# EAGLE board Moonwalker (EAGLE 6.3)
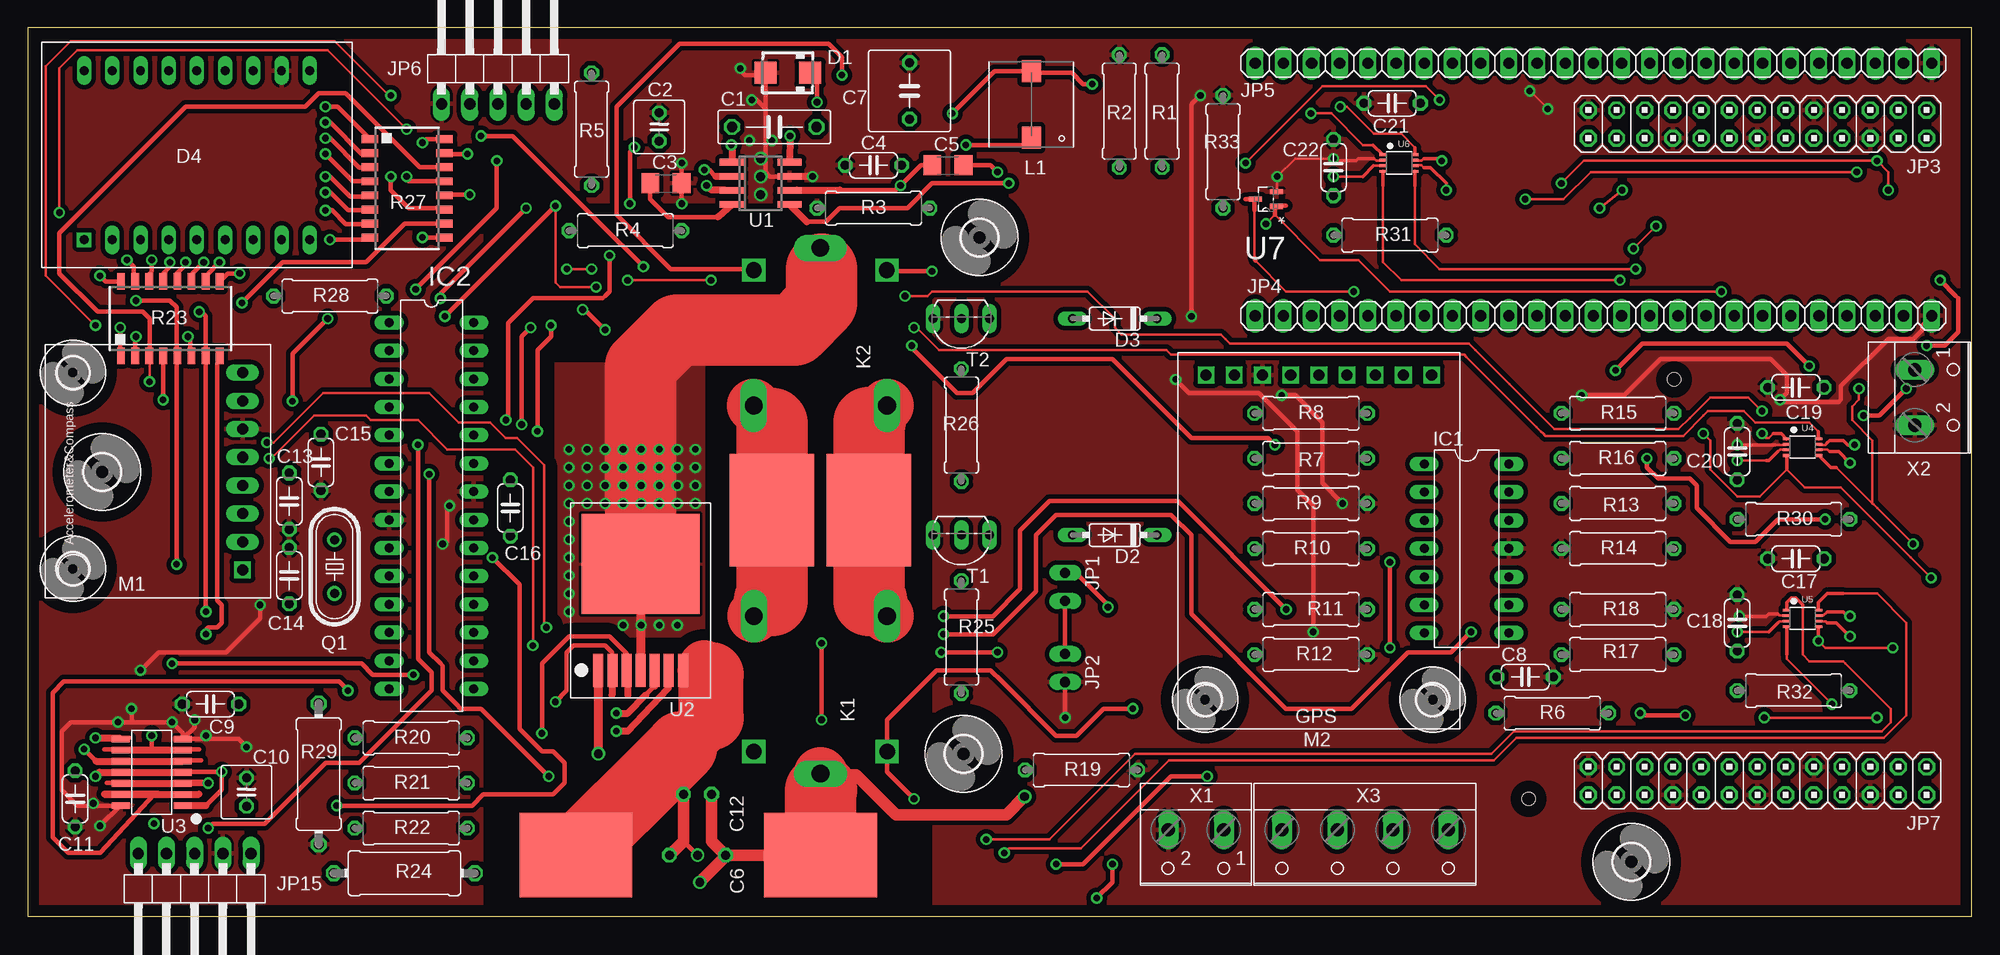
[diagram p5: board, top side]
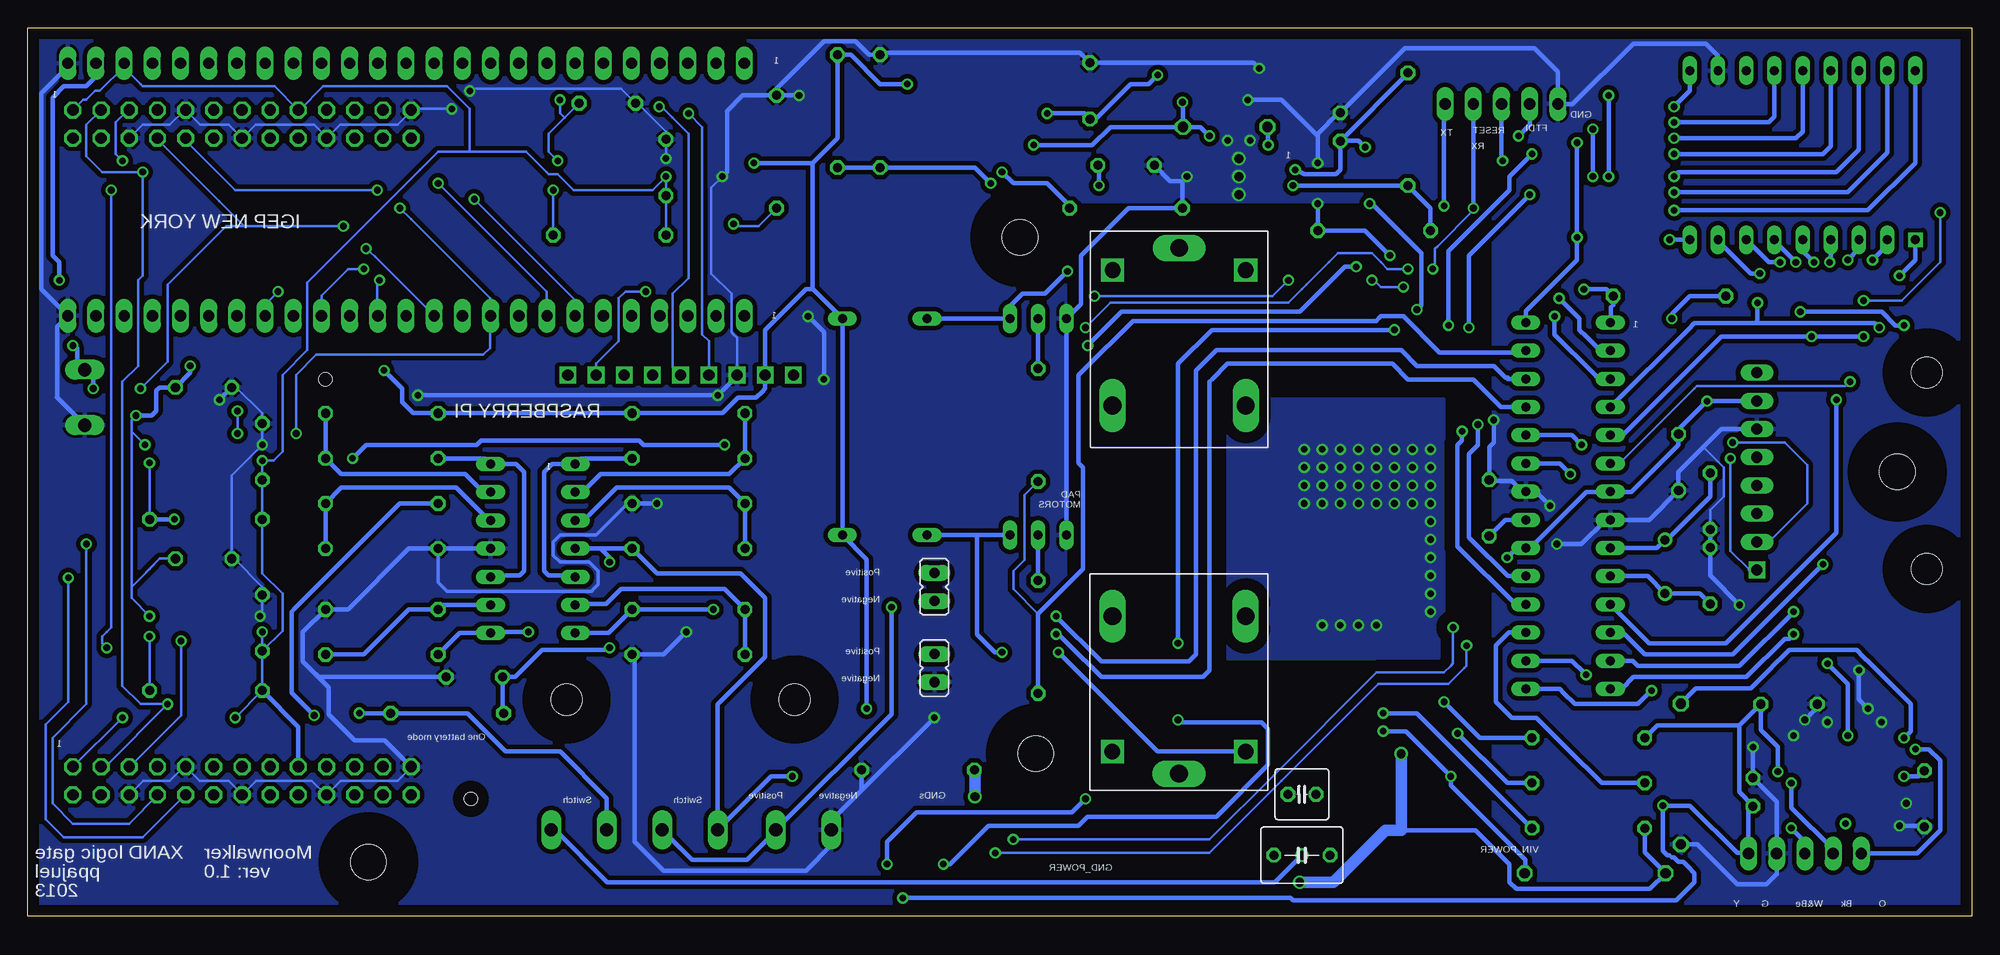
[diagram p6: board, bottom side, seen from below]

Size 175.16 x 80.06 mm. Coordinates in mm from the lower left corner, seen from the top.
Outline: 0,0 175.16,0 175.16,80.06 0,80.06 0,0
Copper layers (1*16): Top 0.07mm / dielectric 1.86mm / Bottom 0.07mm
Design rules "default_moonwalker1": minimum track width 8mil, minimum drill 12mil, track to track 8mil, track to pad 8mil, pad to pad 8mil, via to via 8mil, smd to smd 8mil, copper to edge 40mil, drill to drill 8mil, minimum pad ring 10mil, minimum via ring 8mil, stop-mask expansion 4mil, vias tented up to drill 0mil, thermal gap 10mil
Holes 1.2 mm at 135.23,10.57 148.34,48.36

## Footprints (pad centres in the part's own frame; a part is rotated, then mirrored left to right if it is on the bottom)
C075-032X103 = drill 0.914 octagon: 1 -3.81,0; 2 3.81,0
C025-050X050 = drill 0.813 octagon: 1 -1.27,0; 2 1.27,0
C1206 = smd 1.6 x 1.8: 1 -1.4,0; 2 1.4,0
C050-024X044 = drill 0.813 octagon: 1 -2.54,0; 2 2.54,0
C050-050X075 = drill 0.813 octagon: 1 -2.54,0; 2 2.54,0
C050-075X075 = drill 0.813 octagon: 1 -2.54,0; 2 2.54,0
SMA = smd 2 x 2: A 2,0; C -2,0
DO35-7 = drill 0.813 long: A 3.81,0; C -3.81,0
HEX_SEGMENT_1_DIGIT_0.8 = drill 0.8 square: 1 0,0 | drill 0.8 long: 2 0,-2.54; 3 0,-5.08; 4 0,-7.62; 5 0,-10.16; 6 0,-12.7; 7 0,-15.24; 8 0,-17.78; 9 0,-20.32; 10 15.24,-20.32; 11 15.24,-17.78; 12 15.24,-15.24; 13 15.24,-12.7; 14 15.24,-10.16; 15 15.24,-7.62; 16 15.24,-5.08; 17 15.24,-2.54; 18 15.24,0
3,2 = hole 3.2: 0,0
2,8 = hole 2.8: 0,0
DIL14 = drill 0.813 long: 1 -7.62,-3.81; 2 -5.08,-3.81; 3 -2.54,-3.81; 4 0,-3.81; 5 2.54,-3.81; 6 5.08,-3.81; 7 7.62,-3.81; 8 7.62,3.81; 9 5.08,3.81; 10 2.54,3.81; 11 0,3.81; 12 -2.54,3.81; 13 -5.08,3.81; 14 -7.62,3.81
DIL28-3 = drill 0.813 long: 1 -16.51,-3.81; 2 -13.97,-3.81; 3 -11.43,-3.81; 4 -8.89,-3.81; 5 -6.35,-3.81; 6 -3.81,-3.81; 7 -1.27,-3.81; 8 1.27,-3.81; 9 3.81,-3.81; 10 6.35,-3.81; 11 8.89,-3.81; 12 11.43,-3.81; 13 13.97,-3.81; 14 16.51,-3.81; 15 16.51,3.81; 16 13.97,3.81; 17 11.43,3.81; 18 8.89,3.81; 19 6.35,3.81; 20 3.81,3.81; 21 1.27,3.81; 22 -1.27,3.81; 23 -3.81,3.81; 24 -6.35,3.81; 25 -8.89,3.81; 26 -11.43,3.81; 27 -13.97,3.81; 28 -16.51,3.81
JP1 = drill 0.914 long: 1 0,-1.27; 2 0,1.27
2X13 = drill 1.016 octagon: 1 -15.24,-1.27; 2 -15.24,1.27; 3 -12.7,-1.27; 4 -12.7,1.27; 5 -10.16,-1.27; 6 -10.16,1.27; 7 -7.62,-1.27; 8 -7.62,1.27; 9 -5.08,-1.27; 10 -5.08,1.27; 11 -2.54,-1.27; 12 -2.54,1.27; 13 0,-1.27; 14 0,1.27; 15 2.54,-1.27; 16 2.54,1.27; 17 5.08,-1.27; 18 5.08,1.27; 19 7.62,-1.27; 20 7.62,1.27; 21 10.16,-1.27; 22 10.16,1.27; 23 12.7,-1.27; 24 12.7,1.27; 25 15.24,-1.27; 26 15.24,1.27
1X25 = drill 1.016 long: 1 -29.21,0; 2 -26.67,0; 3 -24.13,0; 4 -21.59,0; 5 -19.05,0; 6 -16.51,0; 7 -13.97,0; 8 -11.43,0; 9 -8.89,0; 10 -6.35,0; 11 -3.81,0; 12 -1.27,0; 13 1.27,0; 14 3.81,0; 15 6.35,0; 16 8.89,0; 17 11.43,0; 18 13.97,0; 19 16.51,0; 20 19.05,0; 21 21.59,0; 22 24.13,0; 23 26.67,0; 24 29.21,0; 25 31.75,0
1X05/90 = drill 1.016 long: 1 -5.08,-3.81; 2 -2.54,-3.81; 3 0,-3.81; 4 2.54,-3.81; 5 5.08,-3.81
POWER_PAD = smd 7.62 x 10.16: 1 0,0
FINDERSERIE36 = drill 1.4 square: 1 0,12; 3 0,0 | drill 1.6 long: 2 -2,6; 4 12.2,0; 5 12.2,12
WE-PD_7332/7345_PLASTIC_BASE = smd 1.7 x 2: 1 0,3; 2 0,-3
COMPASS_&_ACCELEROMETER_ADAFRUIT_LSM303 = drill 1 square: 1 2.54,2.54 | drill 1 long: 2 5.08,2.54; 3 7.62,2.54; 4 10.16,2.54; 5 12.7,2.54; 6 15.24,2.54; 7 17.78,2.54; 8 20.32,2.54
ULTIMATE_GPS_MODULE = drill 1 square: 1 2.54,2.032; 2 5.08,2.032; 3 7.62,2.032; 4 10.16,2.032; 5 12.7,2.032; 6 15.24,2.032; 7 17.78,2.032; 8 20.32,2.032; 9 22.86,2.032
HC49/S = drill 0.813: 1 -2.413,0; 2 2.413,0
0309/10 = drill 0.813 octagon: 1 -5.08,0; 2 5.08,0
4816P = smd 0.7 x 1.5: 1 -4.445,-3.346; 2 -3.175,-3.346; 3 -1.905,-3.346; 4 -0.635,-3.346; 5 0.635,-3.346; 6 1.905,-3.346; 7 3.175,-3.346; 8 4.445,-3.346; 9 4.445,3.346; 10 3.175,3.346; 11 1.905,3.346; 12 0.635,3.346; 13 -0.635,3.346; 14 -1.905,3.346; 15 -3.175,3.346; 16 -4.445,3.346
0411/12 = drill 0.914 octagon: 1 -6.35,0; 2 6.35,0
TO92-CBE = drill 0.813 long: B 0,0; C -2.54,0; E 2.54,0
SO8 = smd 0.6 x 2.2: 1 -1.905,-2.6; 2 -0.635,-2.6; 3 0.635,-2.6; 4 1.905,-2.6; 5 1.905,2.6; 6 0.635,2.6; 7 -0.635,2.6; 8 -1.905,2.6
TO263 = smd 0.9 x 2.95: 1 0,0; 2 1.27,0; 3 2.54,0; 4 3.81,0; 5 5.08,0; 6 6.35,0; 7 7.62,0 | smd 10.6 x 9: 8 3.81,9.6
SOIC14W = smd 1.6 x 0.6: 1 0,0; 2 0,-1; 3 0,-2; 4 0,-3; 5 0,-4; 6 0,-5; 7 0,-6; 8 5.6,-6; 9 5.6,-5; 10 5.6,-4; 11 5.6,-3; 12 5.6,-2; 13 5.6,-1; 14 5.6,0
VFSOP-8 = smd 0.25 x 0.65: P$1 -0.75,-1.45; P$2 -0.25,-1.45; P$3 0.25,-1.45; P$4 0.75,-1.45; P$5 0.75,1.45; P$6 0.25,1.45; P$7 -0.25,1.45; P$8 -0.75,1.45
SOT65P210X110-3N = smd 1.168 x 0.457: 1 -0.94,0.66; 2 -0.94,-0.66; 3 0.94,0
W237-102 = drill 1.194 long: 1 -2.5,-1.27; 2 2.5,-1.27
W237-4 = drill 1.194 long: 1 -7.5,-1.27; 2 -2.5,-1.27; 3 2.5,-1.27; 4 7.5,-1.27

## Placement (x,y rotation side)
C1  100n  [C075-032X103]  67.26,71.12 0 top
C2  10u  [C025-050X050]  56.9,71.12 90 top
C3  8200p  [C1206]  57.51,66.04 0 top
C4  47p  [C050-024X044]  76.2,67.67 180 top
C5  560p  [C1206]  82.91,67.67 0 top
C6  470n  [C050-050X075]  60.35,5.49 180 bottom
C7  470u (LAY: left 10x10mm outline) 47u (optional)  [C050-075X075]  79.45,74.37 90 top
C8  100n  [C050-024X044]  134.92,21.54 0 top
C9  100n  [C050-024X044]  16.46,19.1 180 top
C10  10u  [C025-050X050]  19.71,11.18 90 top
C11  100n  [C050-024X044]  4.27,10.57 270 top
C12  10u  [C025-050X050]  60.35,10.97 180 bottom
C13  22p  [C050-024X044]  23.57,37.39 270 top
C14  22p  [C050-024X044]  23.57,30.68 90 top
C15  100n  [C050-024X044]  26.42,40.89 270 top
C16  100n  [C050-024X044]  43.48,36.78 90 top
C17  100n  [C050-024X044]  159.31,32.21 180 top
C18  100n  [C050-024X044]  154.03,26.42 270 top
C19  100n  [C050-024X044]  159.31,47.65 180 top
C20  100n  [C050-024X044]  154.03,41.86 90 top
C21  100n  [C050-024X044]  122.94,73.25 180 top
C22  100n  [C050-024X044]  117.65,67.46 90 top
D1  MBRA340T3  [SMA]  68.48,76 180 top
D2  1N4148DO35-7  [DO35-7]  97.94,34.34 180 top
D3  1N4148DO35-7  [DO35-7]  97.94,53.85 180 top
D4  HEX_SEGMENT_1_DIGIT_0.8  [HEX_SEGMENT_1_DIGIT_0.8]  5.08,60.96 90 top
H1  MOUNT-HOLE3.2  [3,2]  6.71,40.03 0 top
H2  MOUNT-HOLE3.2  [3,2]  85.75,61.16 0 top
H3  MOUNT-HOLE3.2  [3,2]  84.33,14.63 0 top
H4  MOUNT-HOLE3.2  [3,2]  144.48,4.88 0 top
H5  MOUNT-HOLE2.8  [2,8]  4.06,48.97 0 top
H6  MOUNT-HOLE2.8  [2,8]  4.06,31.29 0 top
H7  MOUNT-HOLE2.8  [2,8]  106.07,19.51 0 top
H8  MOUNT-HOLE2.8  [2,8]  126.59,19.51 0 top
IC1  LM324N  [DIL14]  129.64,33.12 270 top
IC2  MEGA48/88/168-PU  [DIL28-3]  36.37,36.98 270 top
JP1  2.54 mm jumper  [JP1]  93.47,29.67 0 bottom
JP2  2.54 mm jumper  [JP1]  93.47,22.35 0 bottom
JP3  2x13 2.54 mm header  [2X13]  155.85,71.37 180 top
JP4  NW J1(J21)  [1X25]  139.8,54.1 0 top
JP5  NW J4(J22)  [1X25]  139.8,76.86 0 top
JP6  1x5 2.54 mm header  [1X05/90]  42.37,77.01 0 top
JP7  2x13 2.54 mm header  [2X13]  155.85,12.19 180 top
JP8  POWER_PAD  [POWER_PAD]  49.38,5.49 90 top
JP9  POWER_PAD  [POWER_PAD]  71.42,5.49 90 top
JP11  POWER_PAD  [POWER_PAD]  75.79,36.58 180 top
JP12  POWER_PAD  [POWER_PAD]  67.06,36.58 0 top
JP15  2.54 mm pin header  [1X05/90]  15.04,1.83 180 top
K1  FINDER36_SERIES  [FINDERSERIE36]  65.43,14.83 90 bottom
K2  FINDER36_SERIES  [FINDERSERIE36]  77.42,58.22 270 bottom
L1  6u8  [WE-PD_7332/7345_PLASTIC_BASE]  90.42,73.15 180 top
M1  COMPASS_&_ACCELEROMETER_ADAFRUIT_LSM303  [COMPASS_&_ACCELEROMETER_ADAFRUIT_LSM303]  21.89,28.65 90 top
M2  ULTIMATE_GPS_MODULE  [ULTIMATE_GPS_MODULE]  129.03,50.8 180 top
Q1  16 MHz  [HC49/S]  27.64,31.5 90 top
R1  10K 1%  [0309/10]  102.21,72.54 270 top
R2  1K87 0.5%  [0309/10]  98.35,72.54 90 top
R3  33K  [0309/10]  76.2,63.8 0 top
R4  26K1 0.5% 1563153  [0309/10]  53.85,61.77 0 top
R5  133K 0.5% 1563090 130K 0.1% 1083482  [0309/10]  50.8,70.92 90 top
R6  0R  [0309/10]  137.36,18.29 180 top
R7  10K 1%  [0309/10]  115.62,45.31 180 top
R8  10K 1%  [0309/10]  115.62,41.25 0 top
R9  10K 1%  [0309/10]  115.62,37.19 180 top
R10  10K 1%  [0309/10]  115.62,33.12 180 top
R11  4K3 1% 9343202  [0309/10]  115.62,27.64 0 top
R12  10K 1%  [0309/10]  115.62,23.57 0 top
R13  10K 1%  [0309/10]  143.26,37.19 0 top
R14  10K 1%  [0309/10]  143.26,33.12 0 top
R15  10K 1%  [0309/10]  143.26,45.31 0 top
R16  10K 1%  [0309/10]  143.26,41.25 180 top
R17  4K3 1% 9343202  [0309/10]  143.26,23.57 180 top
R18  10K 1%  [0309/10]  143.26,27.64 0 top
R19  0R  [0309/10]  94.95,13.16 0 top
R20  10K  [0309/10]  34.54,16.05 0 top
R21  10K  [0309/10]  34.54,11.99 0 top
R22  560R  [0309/10]  34.54,7.92 180 top
R23  330R  [4816P]  12.85,53.85 0 top
R24  1K2  [0411/12]  33.93,3.86 180 top
R25  10K  [0309/10]  84.12,25.15 270 top
R26  10K  [0309/10]  84.12,44.25 270 top
R27  330R  [4816P]  34.19,65.58 270 top
R28  10K  [0309/10]  27.23,55.88 0 top
R29  50R 1/2W  [0411/12]  26.21,12.8 90 top
R30  10K  [0309/10]  159.11,35.76 0 top
R31  10K  [0309/10]  122.73,61.37 0 top
R32  10K  [0309/10]  159.11,20.32 0 top
R33  1K  [0309/10]  107.7,68.88 270 top
T1  BC548  [TO92-CBE]  84.12,34.34 180 top
T2  BC548  [TO92-CBE]  84.12,53.85 180 top
U1  TPS54231SO8  [SO8]  66.04,66.04 270 top
U2  FAN7093  [TO263]  51.41,22.15 0 top
U3  LB1836M  [SOIC14W]  13.97,9.96 180 top
U4  [VFSOP-8]  159.92,42.27 270 top
U5  [VFSOP-8]  159.92,26.82 270 top
U6  [VFSOP-8]  123.55,67.87 270 top
U7  BSS138PW 1907611  [SOT65P210X110-3N]  111.56,64.62 180 top
X1  5 mm terminal block  [W237-102]  105.26,6.5 180 top
X2  5mm terminal block  [W237-102]  171.3,46.74 270 top
X3  5mm terminal block  [W237-4]  120.5,6.5 180 top

## Tracks (layer width: path | path; a pad name or v marks a point on that pad's centre or on a via)
5VDC  (via drill 0.6)
  Top 0.203: v109.73,67.87 116.64,74.78 125.98,74.78 v127.2,73.56 | 125.78,68.28 125.58,68.07 125.04,68.07 U6.P$7 | 162.15,42.67 161.95,42.47 161.41,42.47 U4.P$7 | U5.P$7 161.79,27.07 162.15,27.43
  Top 0.305: v127.41,68.07 127.2,68.07 127,68.28 125.78,68.28 | v164.59,42.47 163.98,42.47 163.58,42.88 162.36,42.88 162.15,42.67 | v164.19,27.03 163.98,27.03 163.58,27.43 162.36,27.43 162.15,27.43
  Top 0.406: 14.02,13.01 U3.4 14.02,13.01 | 16.05,9.96 17.48,11.38 17.48,11.58 v17.48,13.01 14.02,13.01 | v95.91,74.98 95.1,74.98 94.08,76 90.58,76 L1.2 87.12,76.15 v83.31,72.34 | v99.57,18.69 96.93,18.69 94.49,16.26 92.66,16.26 87.78,21.13 86.77,22.15 81.89,22.15 80.87,21.13 80.67,20.93 77.43,17.69 K1.1 77.43,12.99 v79.86,10.57 | v41.86,32.31 44.3,29.87 44.3,16.87 46.33,14.83 47.35,14.83 48.36,13.82 48.36,11.99 47.55,11.18 47.35,10.97 41.05,10.97 40.03,9.96 39.62,9.96 v27.84,9.96 | v73.36,75.79 73.36,77.42 72.14,78.64 58.73,78.64 53.03,72.95 53.03,64.82 53.03,63.8 53.03,63.2 57.91,58.32 58.52,58.32 59.54,58.32 65.32,58.32 K2.1 | v160.53,49.58 158.5,51.61 147.32,51.61 145.49,51.61 v143.05,49.17 | v169.27,47.55 166.83,45.11 v165.41,45.11 | v97.74,4.67 97.74,3.05 v96.32,1.63 | v23.85,46.41 23.85,50.67 v27.03,53.85 | v171.09,51.41 172.72,51.41 173.94,52.63 173.94,55.68 173.74,55.88 v172.31,57.3 | 6.45,12.96 v6.1,12.6
  Top 0.61: U3.4 U3.11 6.45,12.96 | 16.05,9.96 U3.1
  Bottom 0.203: v164.59,42.47 164.79,42.67 165.81,43.69 165.81,43.89 | 163.27,32.21 C17.1 163.27,32.21 | 163.27,32.21 164.19,31.29 165.81,29.67 | 165.81,29.67 165.81,28.65 v164.19,27.03 | 163.27,32.21 165.81,29.67 | 165.81,29.67 165.81,41.66 165.81,43.89 | C21.1 126.8,71.93 | 126.8,71.93 128.22,70.51 128.22,68.89 v127.41,68.07 | v127.2,73.56 127.2,72.34 126.8,71.93 | 165.81,43.89 165.81,44.7 v165.41,45.11
  Bottom 0.406: JP5.24 169.01,75.64 169.88,74.78 171.91,74.78 172.92,73.76 172.92,59.54 172.31,58.93 v172.31,57.3 | D2.C D3.C 104.44,56.54 | 101.8,34.29 D2.C | JP15.1 20.12,9.5 C10.1 19.71,9.96 20.93,11.18 20.93,17.17 | 4.37,13.01 C11.1 4.78,12.6 v6.1,12.6 | v17.48,13.01 17.48,15.24 19,16.76 C9.1 20.93,17.17 | 104.44,67.87 102.21,70.1 R1.1 100.99,77.62 98.35,74.98 v95.91,74.98 | 104.44,67.87 104.44,56.54 | v83.31,72.34 79.96,72.34 C7.1 78.94,71.83 75.79,74.98 74.17,74.98 v73.36,75.79 | v99.57,18.69 99.57,32.16 D2.C | IC2.20 39.78,33.17 | 39.78,33.17 34.75,38.2 32.61,38.2 IC2.7 32.51,38.2 30.68,38.2 26.42,42.47 C15.1 26.42,43.84 v23.85,46.41 19.38,46.41 M1.7 | 104.44,67.87 v109.73,67.87 | R28.1 25.4,55.88 27.03,54.25 v27.03,53.85 | 20.93,17.17 28.35,17.17 R20.1 | 39.78,33.17 41,33.17 v41.86,32.31 | 20.17,5.69 JP15.1 | 108.71,47.55 109.02,47.24 | 109.02,47.24 109.53,46.74 111.15,46.74 111.96,45.92 112.57,45.31 R7.1 137.57,45.31 R15.1 140.41,45.31 141.43,46.33 141.43,47.55 v143.05,49.17 | v160.53,49.58 160.53,48.97 C19.1 163.07,47.65 163.27,47.65 163.58,47.35 163.58,45.52 163.98,45.11 v165.41,45.11 | v169.27,47.55 169.27,48.47 X2.1 | 170.08,49.29 X2.1 | v96.32,1.63 81.28,1.63 61.37,1.63 61.16,1.42 60.96,1.42 57.1,1.42 46.74,1.42 39.22,1.42 26.62,1.42 24.99,3.05 24.99,3.86 25.6,4.47 26.01,4.88 26.42,4.88 26.62,5.08 26.82,5.28 27.03,5.28 27.23,5.49 27.43,5.49 27.64,5.69 27.84,5.89 27.84,6.3 27.84,7.11 27.84,7.72 v27.84,9.96 25.4,9.96 21.13,5.69 20.93,5.69 20.17,5.69 | 104.44,56.54 104.5,56.49 105.05,56.49 107.7,53.85 108.71,52.83 108.71,50.19 M2.8 108.71,47.55 | v79.86,10.57 81.08,9.35 90.42,9.35 95.1,9.35 97.74,6.71 v97.74,4.67
  Bottom 0.406: 108.71,47.55 109.02,47.24 | 20.17,5.69 JP15.1 | v171.09,51.41 170.89,51.41 170.69,51.21 170.69,49.9 X2.1
#ENABLE_FTDI_COMUNICATION  (via drill 0.6)
  Top 0.203: U4.P$6 161.41,42.06 162.15,42.06 162.36,41.86
  Top 0.305: v164.19,40.84 163.17,41.86 162.36,41.86
  Top 0.406: v40.84,70.31 43.69,70.31 51.61,62.38 v55.47,58.52 | v161.95,35.76 157.68,35.76 155.65,33.73 153.42,33.73 150.37,36.78 150.37,38.81 149.76,39.42 146.91,39.42 145.9,40.44 v145.9,41.25 | v79.65,51.41 79.65,51.21 83.72,47.14 84.94,47.14 85.14,47.14 85.34,47.35 88.19,50.19 97.74,50.19 104.85,43.08 111.76,43.08 v112.37,42.47
  Bottom 0.203: v164.19,40.84 R30.2
  Bottom 0.406: JP6.2 39.83,71.32 v40.84,70.31 | v161.95,35.76 R30.2 | v79.65,51.41 76.61,54.46 60.55,54.46 59.54,55.47 57.1,57.91 56.49,58.52 v55.47,58.52 | v112.37,42.47 119.69,42.47 120.09,42.88 134.31,42.88 134.72,42.47 144.68,42.47 v145.9,41.25
AGND  (via drill 0.8)
  Top 0.813: U2.1 v51.41,14.63
  Top 1.016: C12.2 61.62,6.76 C6.2 | C6.2 JP9.1 | 71.53,12.74 74.64,12.74 78.23,9.14 88.19,9.14 v89.81,10.77 | C6.2 62.89,5.38 v60.55,3.05
  Top 4.826: 71.53,11.38 71.53,12.74 K1.2
  Top 6.452: JP9.1 71.42,11.28 71.53,11.38
  Bottom 0.406: 51.41,7.72 46.94,7.72 44.7,7.72 42.47,5.49 41.66,4.67 41.66,3.05 41.05,2.44 29.01,2.44 R24.2 29.46,5.74 R22.2
  Bottom 1.016: v51.41,14.63 51.41,7.72 52.83,7.72 57.51,3.05 v60.55,3.05 | v89.81,10.77 89.81,13.11 R19.1
ATMEGA_A0  (via drill 0.6)
  Top 0.406: 57.71,22.1 U2.6 | v36.17,39.83 36.17,23.77 37.19,22.76 37.39,22.55 37.39,20.32 38.61,19.1 39.01,18.69 40.84,18.69 v46.94,12.6
  Top 0.61: U2.6 57.71,20.52 54.05,16.66 v53.03,16.66
  Bottom 0.406: IC2.23 37.13,40.79 v36.17,39.83 | v53.03,16.66 51.82,16.66 51,16.66 v46.94,12.6 46.94,11.79 40.89,5.74 40.23,5.08 40.23,3.91 R24.1
ATMEGA_A1  (via drill 0.6)
  Top 0.406: v35.15,42.47 35.15,23.16 36.37,21.95 36.37,20.32 29.87,13.82 26.82,13.82 21.34,8.33 17.27,8.33 16.66,8.33 v16.26,7.92
  Bottom 0.406: 15.04,6.1 JP15.3 15.04,6.71 v16.26,7.92 | IC2.24 36.02,43.33 v35.15,42.47
ATMEGA_A2  (via drill 0.6)
  Top 0.406: v130.05,25.6 128.22,23.77 124.36,23.77 119.28,18.69 113.39,18.69 104.85,27.23 104.85,34.34 103.02,36.17 92.66,36.17 90.83,34.34 90.83,29.26 86.97,25.4 v82.5,25.4
  Bottom 0.406: R17.2 136.25,25.5 IC1.8 133.35,25.6 v130.05,25.6 | IC2.25 41.5,45.87 42.42,45.87 44.7,48.16 44.91,48.36 50.8,48.36 52.22,49.78 67.06,49.78 68.48,48.36 68.68,48.16 68.68,22.15 69.29,21.54 78.44,21.54 81.48,24.59 81.69,24.79 82.3,25.4 v82.5,25.4
ATMEGA_A3  (via drill 0.6)
  Top 0.406: v113.39,27.64 103.63,37.39 92.05,37.39 89.41,34.75 89.41,29.46 86.97,27.03 v82.5,27.03
  Bottom 0.406: IC1.7 122.83,25.5 R11.2 v113.39,27.64 | IC2.26 41.81,48.41 41.81,48.51 42.01,48.51 43.08,49.58 49.99,49.58 51.41,51 68.07,51 69.9,49.17 69.9,23.57 70.51,22.96 76.4,22.96 78.44,22.96 v82.5,27.03
ATMEGA_A4
  Bottom 0.203: 84.12,27.23 86.36,29.46 86.36,30.48 86.36,31.09 85.34,32.11 85.34,37.95 R26.2
  Bottom 0.406: IC2.27 40.34,50.8 47.55,50.8 47.95,50.8 51.21,54.05 53.24,54.05 53.44,53.85 53.65,53.65 75.59,53.65 80.06,49.17 80.47,48.77 80.47,40.84 80.06,40.44 80.06,31.29 84.12,27.23 R25.2
ATMEGA_A5  (via drill 0.6)
  Top 0.406: R27.16 35.89,70.03 v35.56,69.7 | v35.56,61.16 37.51,61.16 R27.9
  Bottom 0.406: v35.56,69.7 35.56,61.57 v35.56,61.16 35.56,59.13 40.18,54.51 IC2.28
ATMEGA_D0_RX  (via drill 0.6)
  Top 0.203: v48.56,58.32 v50.8,58.32 | v79.86,53.03 80.06,53.03 82.09,51 87.38,51 102.62,51 103.02,50.6 129.44,50.6 129.64,50.39 135.94,44.09 136.35,43.69 136.55,43.48 136.75,43.28 143.66,43.28 149.15,43.28 150.98,45.11 151.38,45.52 154.63,45.52 155.65,44.5 159.88,44.5 160.53,44.5 161.34,43.69
  Top 0.305: 161.34,43.69 161.34,43.04 U4.P$8
  Top 0.406: v37.19,55.68 37.19,56.08 v44.91,63.8
  Bottom 0.203: v44.91,63.8 44.91,63.6 48.16,60.35 48.36,60.15 48.36,58.52 v48.56,58.32 | v79.86,53.03 77.62,55.27 61.57,55.27 60.35,56.49 59.94,56.9 57.91,58.93 57.1,59.74 54.05,59.74 53.24,58.93 52.63,58.32 v50.8,58.32
  Bottom 0.406: IC2.2 33.48,50.95 34.75,52.22 35.36,52.83 35.36,53.85 v37.19,55.68 | v44.91,63.8 JP6.4
ATMEGA_D1_TX  (via drill 0.6)
  Top 0.203: v47.55,64.01 47.55,59.74 47.55,57.1 47.95,56.69 51,56.69 v51.21,56.69 | 58.12,57.3 58.73,57.3 | 58.73,57.3 v61.57,57.3 | v79.05,55.88 81.08,55.88 81.48,56.29 95.5,56.29 97.94,53.85 97.94,53.24 97.94,53.03 98.55,52.43 102.21,52.43 107.49,52.43 107.9,52.02 108.31,51.61 129.84,51.61 130.45,51 133.5,47.95 137.57,43.89 148.74,43.89 149.76,44.91 151.59,46.74 153.21,46.74 154.43,46.74 154.84,46.74 155.04,46.74 v156.26,45.52 | v54.05,57.3 58.73,57.3 | v156.26,43.48 156.67,43.08 156.87,43.08 157.28,43.48
  Top 0.305: 157.28,43.48 158,43.48 U4.P$1
  Top 0.406: v37.59,54.05 v47.55,64.01
  Bottom 0.203: v61.57,57.3 62.99,55.88 77.83,55.88 v79.05,55.88 | v54.05,57.3 53.85,57.3 53.24,56.69 v51.21,56.69 | v156.26,43.48 v156.26,45.52
  Bottom 0.406: IC2.3 33.58,48.41 34.14,48.97 37.59,52.43 v37.59,54.05 | v47.55,64.01 47.55,73.1 JP6.5
ATMEGA_D2  (via drill 0.6)
  Top 0.406: v8.33,53.03 8.33,50.58 R23.1 | R27.10 33.96,62.41 30.68,59.13 30.48,58.93 22.96,58.93 v19.3,55.27
  Bottom 0.406: 19.51,53.44 8.74,53.44 v8.33,53.03 | v19.3,55.27 19.3,53.65 19.51,53.44 | IC2.4 25.6,52.83 24.99,53.44 19.51,53.44
ATMEGA_D3  (via drill 0.6)
  Top 0.406: R23.2 9.68,52.15 v9.75,52.22 | v14.43,52.22 14.63,52.02 14.63,50.63 R23.6
  Bottom 0.406: v9.75,52.22 v14.43,52.22 22.55,52.22 31.29,43.48 31.45,43.33 IC2.5
ATMEGA_D4  (via drill 0.6)
  Top 0.203: v10.97,48.16 10.97,50.48 R23.3
  Top 0.406: R27.14 35.33,67.49 28.65,74.17 26.21,74.17 24.99,72.95 14.22,72.95 2.85,61.57 2.85,57.91 6.3,54.46 8.13,54.46 10.36,54.46 10.97,53.85 10.97,50.53 | 10.97,50.53 R23.3 10.97,50.53
  Bottom 0.203: IC2.6 31.55,40.79 31.5,40.84 31.5,41.05 24.99,47.55 24.79,47.75 11.38,47.75 v10.97,48.16
ATMEGA_D5  (via drill 0.6)
  Top 0.406: v12.19,46.53 12.19,50.48 R23.4
  Bottom 0.406: IC2.11 29.06,24.59 22.15,24.59 12.19,34.54 v12.19,46.53
ATMEGA_D6  (via drill 0.6)
  Top 0.203: v34.14,70.92 27.03,78.03 4.47,78.03 2.85,76.4 2.85,63.6 v2.85,63.4
  Top 0.406: 13.41,50.58 R23.5 | v9.75,55.47 10.77,55.47 12.8,55.47 13.41,54.86 13.41,52.83 13.41,50.58 | 13.41,50.58 R23.5 | v34.14,66.65 34.14,66.45 34.34,66.24 37.51,66.24 R27.13 | v13.41,31.7 13.41,50.43 R23.5
  Bottom 0.203: v2.85,63.4 2.85,58.93 6.3,55.47 v9.75,55.47
  Bottom 0.406: v34.14,70.92 v34.14,66.65 | IC2.12 31.45,25.55 29.46,23.57 21.54,23.57 v13.41,31.7
ATMEGA_D7  (via drill 0.6)
  Top 0.203: v32.72,73.97 32.51,73.97 27.64,78.84 3.86,78.84 1.63,76.61 1.63,57.71 v6.1,53.24
  Top 0.406: v15.44,54.46 15.65,54.46 16.05,54.05 16.05,52.22 16.05,50.53 R23.7 16.05,50.48 v16.05,27.43 | v32.72,66.65 32.72,65.43 34.34,63.8 37.41,63.8 R27.11
  Bottom 0.406: v15.44,54.46 13.61,54.46 8.13,54.46 6.91,53.24 v6.1,53.24 | v32.72,73.97 v32.72,66.65 | IC2.13 30.53,23.01 30.07,22.55 20.93,22.55 v16.05,27.43
ATMEGA_D8  (via drill 0.6)
  Top 0.406: R23.8 17.3,50.01 17.07,49.78 17.07,28.45 17.48,28.04 17.48,26.42 17.07,26.01 16.26,26.01 16.05,25.81 v16.05,25.4
  Bottom 0.406: IC2.14 31.55,20.47 30.48,21.54 20.52,21.54 20.32,21.54 16.87,24.99 16.46,24.99 v16.05,25.4
ATMEGA_D9  (via drill 0.6)
  Top 0.406: v28.85,20.32 28.04,21.13 3.25,21.13 2.23,20.12 2.23,7.11 3.66,5.69 6.52,5.69 11.38,10.97
  Top 0.61: U3.13 11.79,10.96 | 11.79,10.96 U3.2 | 11.79,10.96 6.91,10.97 11.38,10.97 15.44,10.97
  Bottom 0.406: IC2.15 37.13,20.47 36.78,20.12 35.76,19.1 30.07,19.1 v28.85,20.32
ATMEGA_D10  (via drill 0.6)
  Top 0.406: 11.18,15.04 11.18,14.96 | 11.38,14.96 11.18,15.16 v11.18,16.26 | v13.01,22.76 30.07,22.76 31.09,21.74 v34.75,21.74 | 6.91,15.04 7.92,15.04 U3.9 | 15.44,15.04 14.43,15.04 U3.6
  Top 0.61: U3.9 11.18,14.96 11.38,14.96 U3.6
  Bottom 0.406: IC2.16 36.02,23.01 34.95,21.95 v34.75,21.74 | v11.18,16.26 11.18,20.93 11.99,21.74 v13.01,22.76
ATMEGA_D11
  Bottom 0.406: IC2.17 41.71,25.55 42.88,24.38 42.88,19.3 41.45,17.88 39.22,17.88 36.37,15.04 33.33,11.99 R21.1
ATMEGA_D12  (via drill 0.6)
  Top 0.406: v47.14,53.24 47.14,52.22 46.33,51.41 45.92,51 v45.92,43.69 | v39.62,68.68 37.61,68.68 R27.15
  Bottom 0.406: IC2.18 41.1,28.09 46.33,33.33 46.33,42.47 45.92,42.88 v45.92,43.69 | v47.14,53.24 47.14,59.94 41.66,65.43 41.66,66.65 v39.62,68.68
ATMEGA_D13  (via drill 0.6)
  Top 0.406: v39.83,65.02 37.61,65.02 R27.12 | v44.5,44.3 44.5,52.22 v45.31,53.03
  Bottom 0.406: IC2.19 41.81,30.63 45.11,33.93 | 45.11,33.93 45.31,34.14 | v39.83,65.02 45.31,59.54 v45.31,53.03 | v44.5,44.3 44.5,42.47 45.31,41.66 45.31,34.14 | 45.31,34.14 45.11,33.93
ATMEGA_RESET  (via drill 0.6)
  Top 0.406: v42.27,68.07 42.27,63.8 v34.95,56.49
  Bottom 0.406: IC2.1 32.51,53.54 32.51,54.86 32.31,55.07 R28.2 32.92,56.49 v34.95,56.49 | JP6.3 42.37,68.17 v42.27,68.07
DGND  (via drill 0.6, 0.8)
  Top 0.203: v135.33,74.37 v136.96,72.75 | 112.57,65.35 v112.57,66.65 114.2,68.28 v117.65,68.28 117.86,68.07 | 121.31,68.28 121.51,68.07 122.05,68.07 U6.P$2 | U5.P$2 157.84,27.07 157.68,27.23 | U4.P$2 158.42,42.47 157.68,42.47 157.48,42.47
  Top 0.305: 117.86,68.07 119.69,68.07 119.89,68.28 121.31,68.28 | v154.23,27.03 156.67,27.03 156.87,27.23 157.68,27.23 | 157.48,42.47 v154.03,42.47
  Top 0.406: JP2.1 v93.47,17.88 | U3.7 18.99,15.96 v19.71,15.24 | v6.5,8.13 8.33,9.96 U3.14 4.47,9.96 3.05,11.38 3.05,16.66 3.86,17.48 6.1,17.48 v8.13,17.48 9.55,17.48 | 14.02,16.01 U3.7 | U3.7 13.97,16.51 v13.01,17.48 9.55,17.48 | v58.93,67.87 58.93,66.06 C3.2 58.93,66.02 v58.93,64.21 | 66.48,72.75 D1.A 66.28,75.79 64.62,75.79 64.21,76.2 v64.21,76.4 | 66.48,72.75 66.48,67.02 66.85,66.65 68.61,66.65 U1.7 68.67,66.65 | v65.23,73.56 65.67,73.56 66.48,72.75 | 112.57,65.35 U7.2 | v37.39,33.53 37.59,33.53 37.8,33.73 37.8,35.87 37.8,36.78 v38,36.98 | v20.93,28.04 20.93,26.82 17.88,23.77 11.79,23.77 v10.16,22.15 | v9.35,18.69 9.35,17.68 9.55,17.48 | v140,46.94 143.87,46.94 147.12,50.19 151.59,50.19 152.2,50.19 152.4,50.19 157.07,50.19 158.09,49.17 158.5,48.77 158.5,47.14 v157.89,46.53 158.09,46.33 163.17,46.33 163.37,46.53 163.37,47.75 167.64,52.02 169.88,52.02 170.69,52.83 170.69,53.24 JP4.25 | v112.98,46.94 114.2,46.94 116.64,44.5 116.64,39.01 v118.47,37.19 | v115.82,25.6 115.82,36.98 114.4,38.41 114.4,43.69 110.95,47.14 105.26,47.14 104.65,47.14 v103.43,48.36 | v52.43,59.54 52.43,57.91 52.43,56.29 52.02,55.88 51.82,55.68 48.97,55.68 45.52,55.68 45.31,55.47 43.28,53.44 43.28,52.83 43.28,44.91 v43.08,44.7 | v104.85,54.05 104.85,71.93 104.85,73.15 v105.66,73.97 | v15.04,17.68 15.04,17.02 U3.7
  Top 0.61: v70.71,66.65 68.68,66.65
  Bottom 0.203: C19.2 156.36,47.65 154.03,45.31 C20.2 154.03,42.67 v154.03,42.47 156.77,39.73 C17.2 156.57,32.21 154.03,29.67 C18.1 154.03,27.23 v154.23,27.03 | JP7.25 140.61,13.41 141.83,12.19 146.96,12.19 JP7.20 148.28,10.92 149.56,12.19 154.58,12.19 JP7.14 155.85,10.97 157.07,12.19 159.66,12.19 JP7.9 161.09,13.46 162.36,12.19 164.74,12.19 JP7.6 | JP3.6 164.79,71.32 162.36,71.32 161.04,72.64 JP3.9 159.61,71.32 157.07,71.32 JP3.14 154.63,71.32 149.35,71.32 148.23,70.21 JP3.20 147.01,71.32 141.83,71.32 140.61,72.54 JP3.25 140.51,72.75 v136.96,72.75 | 111.56,52.43 111.25,52.12 M2.7 111.25,48.67 | 111.56,52.43 111.76,52.63 | v135.33,74.37 135.13,74.57 134.52,74.57 121.72,74.57 C21.2 120.19,73.25 117.65,70.71 C22.2 v117.65,68.28 | 23.57,35.36 23.57,36.58 22.35,37.8 22.35,40.44 24.18,42.27 | v112.57,66.65 113.59,65.63 113.59,63.2 113.59,57.91 111.76,56.08 111.76,52.63 | 111.76,52.63 111.56,52.43
  Bottom 0.305: R9.1 121.11,37.19 123.75,34.54 123.95,34.34 127.2,34.34 127.81,33.73 127.81,32.51 127.2,31.9 124.56,31.9 123.95,31.29 123.75,31.09 123.75,29.87 124.16,29.46 124.36,29.26 136.14,29.26 137.36,29.26 138.18,30.07 R14.1
  Bottom 0.406: 138.07,33.02 R14.1 | 149.56,22.15 148.03,20.62 148.03,18.19 145.69,15.85 143,15.85 JP7.25 | 149.56,22.15 150.37,22.96 150.37,25.6 R18.2 146.3,27.64 140.82,33.12 R14.1 | X2.2 172.57,46.78 172.52,46.83 172.52,50.6 172.52,50.8 172.52,53.14 JP4.25 173.94,56.49 173.94,68.68 173.94,74.17 171.55,76.56 JP5.25 | 100.48,10.87 102.76,8.6 X1.2 102.76,7.58 102.76,6.56 102.76,6.36 105.05,4.06 117.86,4.06 120.5,6.71 120.5,10.77 120.5,23.37 R12.2 117.86,23.57 v115.82,25.6 | 100.48,10.87 v93.47,17.88 | T1.E T2.E 80.26,55.17 80.26,59.54 76,63.8 R3.1 71.12,66.24 | R19.2 100.03,11.33 100.48,10.87 | v19.71,15.24 C10.2 17.58,10.31 JP15.2 17.58,3.76 17.68,3.66 18.49,2.85 21.13,2.85 24.74,6.45 R29.1 | v6.5,8.13 4.37,8.13 C11.2 | v58.93,64.21 R4.2 54.66,61.77 v52.43,59.54 | v65.23,73.56 62.18,73.56 58.93,70.31 v58.93,67.87 58.93,70.51 57.05,72.39 C2.2 51.05,78.23 39.42,78.23 37.29,76.1 JP6.1 37.24,73.15 35.97,73.15 30.48,78.64 23.98,78.64 22.86,77.52 D4.11 | 71.12,66.24 v70.71,66.65 | v64.21,76.4 64.72,76.91 C7.2 80.37,77.83 98.15,77.83 R2.2 99.36,77.62 100.58,78.84 103.43,78.84 107.7,74.57 R33.1 | 71.12,66.24 72.24,66.24 C4.2 | IC1.11 R14.1 | C8.2 148.95,21.54 149.56,22.15 | R33.1 110.74,73.97 112.17,72.54 112.17,67.06 v112.57,66.65 | v37.39,33.53 35.15,33.53 32.97,35.71 IC2.8 29.06,35.71 C15.2 26.42,40.03 24.18,42.27 22.55,43.89 21.74,43.89 M1.6 | v20.93,28.04 23.57,30.68 C14.2 C13.2 23.57,35.36 | v10.16,22.15 10.16,19.51 v9.35,18.69 | v38,36.98 39.22,38.2 40.13,38.2 IC2.22 40.49,38.25 41.45,39.22 43.38,39.22 C16.2 43.48,42.27 43.08,42.67 v43.08,44.7 | v118.47,37.19 R9.1
  Bottom 0.406: 119.28,46.94 120.29,46.94 | 120.29,46.94 v140,46.94 | 120.29,46.94 v112.98,46.94 111.25,48.67 M2.7 | v105.66,73.97 R33.1 | C19.2 v157.89,46.53 | v103.43,48.36 103.43,52.63 v104.85,54.05 | C9.2 13.92,18.8 14.63,18.09 14.83,17.88 v15.04,17.68
  other vias: 66.04,65.02 65.02,69.9 67.06,69.9 66.04,68.28 66.04,66.65 5.89,10.16 16.05,16.26
  pour Top (isolate 0.406): 176.38,-1.83 81.69,-1.83 81.69,64.41 40.84,64.41 40.84,-5.08 -2.64,-5.08 -2.64,2.44 -3.66,2.44 -3.66,88.6 176.38,88.6
  pour Bottom (isolate 0.406): 176.99,-2.64 81.69,-2.64 81.69,64.41 43.08,64.41 43.08,-5.69 -2.84,-5.69 -2.84,5.28 -3.86,5.28 -3.86,87.78 176.99,87.78
ENGPS  (via drill 0.6)
  Top 0.203: v152.6,56.29 122.73,56.29 119.89,59.13 116.43,59.13 112.37,63.2 v111.56,62.38 | 112.37,63.83 U7.1 112.57,64.01 112.78,64.01
  Top 0.406: 112.78,64.01 113.39,64.01 | 112.37,63.83 112.37,63.2
  Bottom 0.203: JP4.18 153.77,54.91 153.77,55.12 v152.6,56.29 | R33.2 109.32,62.18 111.35,62.18 v111.56,62.38
ENPINGPS  (via drill 0.6)
  Top 0.203: 110.62,59.05 113.39,56.29 v119.48,56.29 | 110.54,59.33 110.54,63.6 | U7.3 110.54,64.62
  Top 0.406: 110.62,59.05 110.54,59.33 | 109.73,64.62 110.54,64.62 | 110.54,64.62 U7.3 | 110.54,64.62 110.54,63.6
  Bottom 0.203: v119.48,56.29 121.31,56.29 121.92,55.68 121.92,51.82 123.95,49.78 M2.2
I2C5V_SCL  (via drill 0.6)
  Top 0.203: 163.58,29.06 166.62,29.06 169.27,26.42 169.27,18.09 167.23,16.05 134.11,16.05 132.08,14.02 109.93,14.02 102.82,14.02 94.89,6.1 88.39,6.1 v87.99,5.69 | v21.74,41.25 21.95,41.25 25.81,45.11 30.48,45.11 30.89,44.7 35.15,44.7 37.8,42.06 41.45,42.06 42.88,42.06 43.89,42.06 45.52,40.44 v45.52,24.38
  Top 0.305: 163.58,29.06 162.15,29.06 161.34,28.25 161.34,27.6 U5.P$8
  Bottom 0.203: 20.02,31.19 21.74,32.92 v21.74,41.25 | v87.99,5.69 68.68,5.69 62.18,12.19 53.44,20.93 48.56,20.93 47.14,20.93 45.72,22.35 45.52,22.55 v45.52,24.38
  Bottom 0.406: M1.1 20.02,31.19
I2C5V_SDA  (via drill 0.6)
  Top 0.203: 159.92,27.84 159.92,23.57 160.53,22.96 163.58,22.96 163.78,22.76 167.84,18.69 167.84,17.48 167.03,16.66 133.91,16.66 131.88,14.63 109.93,14.63 99.77,14.63 92.05,6.91 v86.36,6.91 | v21.54,42.67 22.15,42.67 26.62,47.14 35.97,47.14 36.17,47.14 38.81,44.5 41.66,44.5 43.08,43.08 44.09,43.08 46.53,40.64 46.53,26.21 v46.74,26.01
  Top 0.305: 159.92,27.84 159.92,28.04 159.31,28.65 158.9,28.65 158.5,28.25 158.5,27.6 U5.P$1
  Bottom 0.203: 18.29,33.73 14.83,37.19 14.83,40.64 16.87,42.67 21.34,42.67 v21.54,42.67 | v86.36,6.91 68.68,6.91 62.89,12.7 | 62.89,12.7 62.38,13.21 | 62.89,12.7 53.65,21.95 47.55,21.95 46.94,22.55 46.74,22.76 v46.74,26.01
  Bottom 0.406: 18.29,33.73 M1.2
I2C_SCL  (via drill 0.6)
  Top 0.203: v138.18,66.04 140.21,68.07 v166.62,68.07 167.64,67.06 v167.64,65.43 | 161.34,26.05 U5.P$5 | v161.34,24.79 161.95,24.18 v168.05,24.18
  Top 0.305: 161.34,26.05 v161.34,24.79
  Bottom 0.203: JP3.5 166.12,72.64 167.23,71.53 167.23,69.09 167.23,68.68 v166.62,68.07 | v138.18,66.04 128.42,56.29 128.42,54.15 JP4.8 | JP7.5 165.96,13.46 161.34,18.09 v161.34,24.79 | v167.64,65.43 167.64,40.23 167.64,26.01 168.05,25.6 168.45,25.2 168.45,24.59 v168.05,24.18
I2C_SDA  (via drill 0.6)
  Top 0.203: v164.79,67.06 140.82,67.06 138.38,64.62 v134.93,64.62 | 158.5,26.05 U5.P$4 | 158.5,23.57 158.5,23.16 v162.56,19.1
  Top 0.305: 158.5,23.57 158.5,26.05 U5.P$4
  Bottom 0.203: JP3.3 169.88,71.32 169.88,68.68 169.88,68.48 168.45,67.06 v164.79,67.06 164.79,57.71 165.2,57.3 165.2,51.82 165.2,49.58 166.62,48.16 166.62,20.73 165,19.1 v162.56,19.1 168.15,13.51 168.55,13.51 JP7.3 | v134.93,64.62 125.78,55.47 125.78,54.15 JP4.7
M_DRIVER_OUT  (via drill 0.6)
  Top 0.813: U2.8 U2.4
  Top 1.93: K2.2 71.53,60.22 71.53,60.35 71.53,58.32
  Top 6.452: U2.8 55.22,49.53 57.51,51.82 58.12,52.43 58.52,52.83 69.09,52.83 71.53,55.27 71.53,56.9 71.53,58.32
  other vias: 48.77,42.06 50.39,42.06 52.02,42.06 53.64,42.06 55.27,42.06 56.9,42.06 48.77,40.44 50.39,40.44 52.02,40.44 53.64,40.44 55.27,40.44 56.9,40.44 48.77,38.81 50.39,38.81 52.02,38.81 53.64,38.81 55.27,38.81 56.9,38.81 48.77,37.19 48.77,35.56 48.77,33.93 48.77,32.31 48.77,30.68 48.77,29.06 58.52,42.06 58.52,40.44 58.52,38.81 50.39,37.19 52.02,37.19 53.64,37.19 55.27,37.19 56.9,37.19 58.52,37.19 58.52,26.21 56.9,26.21 55.27,26.21 53.64,26.21 48.77,27.43 60.15,42.06 60.15,40.44 60.15,38.81 60.15,37.19
  pour Bottom (isolate 1.016): 47.55,23.37 47.55,46.63 67.06,46.63 67.06,23.16 48.16,23.16
  pour Top (isolate 1.016): 60.96,49.78 60.96,25.2 47.55,25.2 47.55,49.78
MAIN_CORE_POWER  (via drill 0.6)
  Top 0.203: v166.62,17.88 v156.46,17.88 | v154.03,25.6 154.63,25.6 156.87,25.6 | 156.67,41.05 v154.03,41.05 | U6.P$3 121.26,67.62 | 120.29,66.65 v117.65,66.65 | 157.68,41.86 157.89,42.06 158.42,42.06 U4.P$3 | U5.P$3 158.04,26.57 157.84,26.57 157.68,26.42
  Top 0.305: 120.29,66.65 121.26,67.62 | 156.67,41.05 156.87,41.05 157.68,41.86 | 157.68,26.42 156.87,25.6
  Bottom 0.203: C18.2 v154.03,25.6 | C18.2 R32.1 v156.46,17.88 | JP3.1 170.18,73.56 169.88,73.56 169.06,74.37 168.66,74.37 166.47,76.56 JP5.23 166.47,76.45 165,74.98 164.79,74.78 152.91,74.78 JP3.17 150.67,72.64 148.54,74.78 138.99,74.78 137.36,74.78 135.33,72.75 135.33,68.89 | JP7.1 v166.62,17.88 | R31.1 C22.1 v117.65,66.65 118.87,65.43 125.98,65.43 127.41,66.85 128.22,66.85 128.42,67.06 130.25,68.89 135.33,68.89 | C18.2 152.2,25.7 152.2,29.06 154.03,30.89 154.03,31.7 R30.1 C20.1 v154.03,41.05 153.01,41.05 152.2,41.86 152.2,48.77 149.96,51 149.96,57.1 139.8,67.26 138.18,68.89 135.33,68.89
  Bottom 0.406: JP7.17 150.77,17.07 R32.1
N$1  (via drill 0.6)
  Top 0.406: C5.1 80.47,67.67 v78.64,65.84 78.21,65.41 73.15,65.43
  Top 0.61: U1.6 69.29,65.43 73.15,65.43
  Bottom 0.406: v78.64,65.84 78.64,67.56 C4.1
N$2  (via drill 0.6)
  Top 0.406: v87.38,67.06 86.77,67.67 C5.2
  Bottom 0.406: R3.2 81.28,64.01 83.31,66.04 86.16,66.04 86.36,66.04 v87.38,67.06
N$3  (via drill 0.6)
  Top 0.406: v61.16,65.84 61.57,65.43 | 62.79,65.43 63.41,65.43 U1.3
  Top 0.61: 62.79,65.43 61.57,65.43
  Bottom 0.406: R4.1 48.77,63.8 R5.1 60.55,65.84 v61.16,65.84
N$4
  Top 0.406: 59.74,62.99 59.54,62.99 | 59.54,62.99 57.71,62.99 56.08,64.62 56.08,66.02 C3.1 | 62.18,62.99 59.54,62.99
  Top 0.61: U1.4 62.18,62.99
N$5  (via drill 0.6)
  Top 0.406: v27.23,60.96 30.66,60.96 R27.8
  Bottom 0.406: D4.9 27.03,60.96 v27.23,60.96
N$6  (via drill 0.6)
  Top 0.406: U3.8 9.05,15.96 9.14,16.05
  Top 0.61: v6.1,16.05 8.27,16.05 U3.8
  Bottom 0.406: v6.1,16.05 5.49,16.66 5.49,19.1 6.91,20.52 9.14,22.76 9.75,23.37 10.36,23.98 16.46,23.98 17.07,23.37 17.68,22.76 18.29,22.15 19.91,20.52 24.84,20.52 R29.2
N$7  (via drill 0.6)
  Top 0.406: 68.68,67.99 U1.8 | v71.12,73.36 71.12,75.36 D1.C | v84.53,69.49 89.77,69.49 L1.1
  Top 0.61: v68.68,70.31 U1.8
  Bottom 0.406: C1.2 69.49,71.12 v68.68,70.31 | C1.2 71.07,73.3 v71.12,73.36 | C1.2 77.62,71.12 79.25,69.49 v84.53,69.49
N$8  (via drill 0.6)
  Top 0.406: 63.44,69.45 v63.4,69.49
  Top 0.61: 63.44,69.45 U1.1
  Bottom 0.406: v63.4,69.49 63.4,71.07 C1.1
N$9  (via drill 0.6)
  Top 0.406: v88.39,66.04 81.48,66.04 79.25,63.8 73.15,63.8 71.93,62.59 70.19,62.59
  Top 0.61: U1.5 70.19,62.59
  Bottom 0.406: R1.2 R2.1 89.81,67.46 v88.39,66.04
N$10
  Top 0.406: JP1.1 JP2.2
N$11
  Bottom 0.406: IC2.9 28.37,33.17 Q1.2 27.46,33.91 23.57,37.8 C13.1
N$12
  Bottom 0.406: IC2.10 29.18,30.63 Q1.1 24.51,29.08 C14.1
N$13
  Bottom 0.406: R10.2 R9.2 111.96,38.61 122.12,38.61 125.07,35.66 IC1.3
N$14
  Bottom 0.406: R7.2 R8.1 111.96,39.83 123.55,39.83 125.17,38.2 IC1.2
N$15
  Bottom 0.406: IC1.12 133.6,35.66 136.55,38.61 146.91,38.61 R13.2 R14.2
N$16
  Bottom 0.406: IC1.13 134.11,38.2 135.74,39.83 138.99,39.83 146.91,39.83 R16.1 R15.2
N$17
  Bottom 0.406: R16.2 133.96,41.25 IC1.14 131.17,40.74 131.06,40.64 130.45,40.03 130.45,31.09 130.86,30.68 133.35,30.68 IC1.10
N$18
  Bottom 0.406: R8.2 125.32,41.25 IC1.1 127.91,40.74 128.02,40.64 128.63,40.03 128.63,31.09 128.22,30.68 125.93,30.68 IC1.5
N$19  (via drill 0.6)
  Top 0.406: R23.16 7.02,57.19 6.91,57.3 v6.5,57.71
  Bottom 0.406: v6.5,57.71 5.08,59.13 D4.1
N$20
  Bottom 0.406: IC2.21 42.01,35.71 C16.1
N$21  (via drill 0.6)
  Top 0.406: v26.82,71.53 27.23,71.53 30.07,68.68 30.77,68.68 R27.2
  Bottom 0.406: D4.13 17.78,72.03 18.29,71.53 v26.82,71.53
N$22
  Bottom 0.406: IC1.6 125.73,28.14 123.04,28.14 121.72,29.46 112.37,29.46 R11.1 R12.1
N$23
  Top 4.826: 75.9,44.5 K2.4 | 76.02,28.45 K1.5
  Top 6.452: 75.9,44.5 75.79,44.5 JP11.1 75.79,28.45 76.02,28.45
N$24
  Bottom 0.406: IC1.9 137.77,28.04 R18.1 140.82,27.64 144.88,23.57 R17.1
N$25  (via drill 0.6)
  Top 0.406: 56.49,20.73 56.08,20.32 55.68,19.91
  Top 0.61: v53.03,18.29 54.05,18.29 55.68,19.91 | 56.49,20.73 U2.5
  Bottom 0.406: R22.1 49.99,18.29 v53.03,18.29
N$26  (via drill 0.6)
  Top 0.406: v47.55,19.3 48.56,20.32 48.56,23.77 49.17,24.38 52.02,24.38 52.63,23.77 U2.2
  Top 0.61: U2.2 52.63,21.74 52.63,19.91
  Bottom 0.406: v47.55,19.3 44.3,16.05 R20.2
N$27  (via drill 0.6)
  Top 0.406: U2.3 53.95,23.67 | v46.33,16.46 46.33,19.51 46.33,22.76 47.75,24.18 47.95,24.38 48.77,25.2 52.43,25.2 53.95,23.67 | 53.95,23.67 53.97,23.15
  Top 0.61: 53.97,23.15 54.05,20.93 54.05,19.91
  Bottom 0.406: v46.33,16.46 41.86,11.99 R21.2
N$28  (via drill 0.6)
  Top 0.406: v8.94,59.13 9.55,58.52 9.55,57.32 R23.15
  Bottom 0.406: D4.2 7.62,60.45 v8.94,59.13
N$29  (via drill 0.6)
  Top 0.406: v11.18,59.13 11.18,58.32 11.18,58.12 10.97,57.91 10.97,57.22 R23.14
  Bottom 0.406: D4.3 10.16,60.15 v11.18,59.13
N$30  (via drill 0.6)
  Top 0.406: v12.8,58.93 12.8,58.52 12.19,57.91 12.19,57.22 R23.13
  Bottom 0.406: D4.4 12.7,59.03 v12.8,58.93
N$31  (via drill 0.6)
  Top 0.406: v14.22,58.93 14.22,58.73 13.41,57.91 13.41,57.27 R23.12
  Bottom 0.406: D4.5 15.24,59.94 v14.22,58.93
N$32  (via drill 0.6)
  Top 0.406: v26.82,72.95 27.92,72.95 R27.1
  Bottom 0.406: D4.10 25.4,74.37 v26.82,72.95
N$33
  Top 4.826: 67.06,44.38 K2.5 | 66.84,28.45 K1.4
  Top 6.452: 67.06,44.38 67.06,44.3 JP12.1 67.06,28.45 66.84,28.45
N$34  (via drill 0.6)
  Top 0.406: v82.3,23.77 v87.38,23.77
  Bottom 0.406: D2.A 89.81,34.34 | 89.81,34.34 T1.C | 89.81,34.34 89.61,34.14 89.61,25.4 87.99,23.77 v87.38,23.77 | K1.3 73.36,14.83 v82.3,23.77
N$35  (via drill 0.6)
  Top 0.406: v15.85,58.93 14.83,57.91 14.83,57.27 R23.11
  Bottom 0.406: D4.6 17.78,60.86 v15.85,58.93
N$36  (via drill 0.6)
  Top 0.406: v17.27,58.93 16.26,57.91 16.05,57.71 16.05,57.22 R23.10
  Bottom 0.406: D4.7 18.29,58.93 v17.27,58.93
N$37  (via drill 0.6)
  Top 0.406: 77.52,58.12 K2.3 | 77.52,58.12 K2.3 | v81.48,58.12 77.52,58.12 | 77.52,58.12 K2.3
  Bottom 0.406: D3.A T2.C 86.67,54.97 85.55,56.08 83.92,56.08 83.52,56.08 v81.48,58.12
N$38
  Bottom 0.406: T2.B R26.1
N$39
  Bottom 0.406: T1.B R25.1
N$40  (via drill 0.6)
  Top 0.203: U5.P$6 162,26.57 162.15,26.42
  Top 0.305: v164.19,25.2 162.97,26.42 162.15,26.42
  Bottom 0.203: v164.19,25.2 R32.2
N$41  (via drill 0.6)
  Top 0.406: v19.1,57.91 18.02,57.91 R23.9
  Bottom 0.406: D4.8 22.86,60.86 19.91,57.91 v19.1,57.91
N$42  (via drill 0.6)
  Top 0.406: v26.82,63.6 27.43,63.6 28.65,62.38 30.82,62.38 R27.7
  Bottom 0.406: D4.18 5.08,67.87 9.35,63.6 v26.82,63.6
N$43  (via drill 0.6)
  Top 0.406: v26.82,65.23 27.23,65.23 28.85,63.6 30.77,63.6 R27.6
  Bottom 0.406: D4.17 7.62,68.78 10.36,66.04 11.18,65.23 v26.82,65.23
N$44  (via drill 0.6)
  Top 0.406: v26.82,66.65 27.23,66.65 29.06,64.82 30.71,64.82 R27.5
  Bottom 0.406: D4.16 10.16,69.09 12.19,67.06 26.42,67.06 v26.82,66.65
N$45  (via drill 0.6)
  Top 0.406: v26.82,68.68 29.26,66.24 30.82,66.24 R27.4
  Bottom 0.406: D4.15 12.7,69.39 13.41,68.68 v26.82,68.68
N$46  (via drill 0.6)
  Top 0.406: v26.82,70.1 27.23,70.1 29.87,67.46 30.82,67.46 R27.3
  Bottom 0.406: D4.14 15.24,70.71 15.85,70.1 v26.82,70.1
N$47  (via drill 0.6)
  Top 0.203: 127.81,66.04 v127.81,65.43 | 125.78,67.46 125.58,67.67 125.04,67.67 U6.P$6
  Top 0.305: 127.81,66.04 126.39,67.46 125.78,67.46
  Bottom 0.203: v127.81,65.43 R31.2
N$48  (via drill 0.6)
  other vias: 11.38,8.33
SERVO_POWER1  (via drill 0.6)
  Top 0.406: U3.3 14,11.99 12.19,11.99 7.11,11.99
  Top 0.61: U3.12 U3.3 v16.26,11.99
  Bottom 0.406: JP15.4 12.5,5.99 16.26,9.75 v16.26,11.99
SERVO_POWER2  (via drill 0.6)
  Top 0.406: 6.16,13.96 v5.08,15.04 | 15.65,14.02 14.22,14.02 U3.5
  Top 0.61: U3.5 U3.10 6.16,13.96
  Bottom 0.406: v5.08,15.04 3.86,15.04 2.85,14.02 2.85,7.72 4.88,5.69 4.93,5.64 JP15.5
UART_RX  (via drill 0.6)
  Top 0.203: v143.66,65.43 v141.63,63.8 | v171.5,30.48 169.67,32.31 163.37,38.61 160.12,38.61 158.5,40.23 156.06,37.8 154.43,37.8 154.03,37.8 151.59,40.23 151.59,42.88 v150.98,43.48 | U4.P$4 158.36,41.52
  Top 0.305: 158.5,40.23 158.5,41.49 U4.P$4
  Bottom 0.203: JP3.10 160.93,69.9 156.46,65.43 144.68,65.43 v143.66,65.43 | v141.63,63.8 140.61,62.79 133.5,55.68 133.5,54.15 JP4.10 133.5,54.05 133.5,51.21 134.11,50.6 135.94,50.6 147.73,50.6 149.15,50.6 150.98,48.77 150.98,47.35 v150.98,43.48 | JP7.10 160.99,10.92 164.79,7.11 171.7,7.11 171.91,7.11 173.53,8.74 173.53,17.27 171.5,19.3 v171.5,30.48
UART_TX  (via drill 0.6)
  Top 0.203: v146.71,62.18 v144.68,60.15 | v169.88,33.53 166.62,36.78 166.32,37.08 | 166.32,37.08 166.22,37.19 | v165,47.55 165,46.53 164.39,45.92 164.39,44.7 166.22,42.88 166.22,37.19 | 166.22,37.19 166.32,37.08 | 166.22,37.19 162.97,40.44
  Top 0.305: 162.97,40.44 162.45,40.44 U4.P$5
  Bottom 0.203: JP3.8 163.47,70 157.89,64.41 155.65,62.18 | v144.68,60.15 143.87,59.44 JP4.12 | 155.65,62.18 v146.71,62.18 | JP7.8 163.47,10.87 166.01,8.33 171.09,8.33 172.92,10.16 172.92,16.05 169.88,19.1 169.88,30.07 v169.88,33.53 | 155.65,62.18 157.28,62.18 162.56,56.9 162.56,49.99 v165,47.55
UARTGPS5V_RX  (via drill 0.6)
  Top 0.203: v115.62,72.34 117.25,72.34 117.45,72.34 120.29,69.49 121.22,69.49
  Top 0.305: 121.22,69.49 U6.P$1
  Bottom 0.203: v115.62,72.34 114.4,71.12 114.4,52.43 113.79,51.82 M2.6
UARTGPS5V_TX  (via drill 0.6)
  Top 0.203: 125,69.26 123.75,70.51 121.31,70.51 118.87,72.95 v118.26,72.95
  Top 0.305: 125,69.26 U6.P$8
  Bottom 0.203: v118.26,72.95 118.06,72.95 117.04,71.93 115.62,70.51 115.62,57.51 117.04,56.08 117.04,49.48 M2.5
UARTGPS_RX  (via drill 0.6)
  Top 0.203: v144.88,58.32 127.2,58.32 124.97,60.55 124.97,65.84 | 124.97,67.09 U6.P$5
  Top 0.305: 124.97,65.84 124.97,67.09 U6.P$5
  Bottom 0.203: 148.74,54.15 JP4.16 148.69,55.93 146.3,58.32 v144.88,58.32
UARTGPS_TX  (via drill 0.6)
  Top 0.203: v143.46,57.3 123.75,57.3 122.12,58.93 122.12,65.84 | 122.12,67.09 U6.P$4
  Top 0.305: 122.12,65.84 122.12,67.09 U6.P$4
  Bottom 0.203: v143.46,57.3 143.66,57.1 143.66,54.15 JP4.14
VIN_CONTROL  (via drill 0.6)
  Top 0.406: v97.33,27.84 97.33,28.04 94.49,30.89 93.52,30.89 JP1.2
  Bottom 0.406: v97.33,27.84 97.33,18.2 X1.1 107.76,7.66 108.1,7.32 110.34,5.08 115.31,5.08 X3.3
VIN_CONTROL_SWITCH  (via drill 0.6)
  Top 0.406: v60.96,67.26 61.37,67.26 61.98,66.65 | 63.41,66.65 U1.2 | v122.73,24.18 122.73,31.5 v122.73,31.9 | v49.99,54.66 50.19,54.66 v52.02,52.83 | v106.27,12.6 103.02,12.6 96.93,6.5 95.3,4.88 95.1,4.67 94.69,4.67 v92.66,4.67 | v54.25,64.21 54.25,68.89 v54.66,69.29 | v71.53,17.68 v71.53,24.59
  Top 0.61: 63.41,66.65 61.98,66.65
  Bottom 0.406: 112.98,7.79 X3.4 | R5.2 50.8,75.95 C2.1 | C2.1 56.9,67.26 57.3,66.85 60.15,66.85 v60.96,67.26 | IC1.4 124.36,33.12 123.55,33.12 | 123.55,33.12 R10.1 118.47,30.89 110.95,30.89 108.71,28.65 108.71,23.37 110.74,21.34 113,19.08 X3.4 | v122.73,24.18 122.94,23.98 128.83,23.98 131.27,21.54 C8.1 132.38,18.39 R6.2 | v122.73,31.9 122.73,32.31 123.55,33.12 | X3.4 112.72,7.77 | v71.53,17.68 71.32,17.48 64.01,17.48 63.4,16.87 63.4,13.61 68.07,8.94 79.65,8.94 80.47,8.13 88.59,8.13 92.05,4.67 v92.66,4.67 | v54.66,69.29 55.27,69.9 56.84,69.9 C2.1 | v52.02,52.83 66.04,52.83 68.48,52.83 71.53,49.78 71.53,47.35 v71.53,24.59 | v49.99,54.66 49.58,55.07 49.58,59.74 54.05,64.21 v54.25,64.21 | v106.27,12.6 108.17,12.6 X3.4
VIN_POWER  (via drill 0.8)
  Top 0.406: v60.35,5.49 59.08,6.76
  Top 1.016: 59.08,14.48 58.62,14.94 | 60.96,22.55 59.44,22.55 U2.7 | C6.1 59.08,6.76 C12.1 59.08,12.45 57.61,13.92
  Top 4.572: 61.57,21.74 61.57,21.95 60.96,22.55
  Top 5.08: 58.93,15.24 61.57,17.88
  Top 5.842: 61.57,17.88 61.57,21.74
  Top 6.452: JP8.1 49.38,5.69 57.61,13.92 58.62,14.94 58.93,15.24
  Bottom 0.406: X3.1 127.66,7.77 122.94,3.05 62.79,3.05 v60.35,5.49
VIN_POWER_SWITCH  (via drill 0.6)
  Top 0.406: v149.35,18.09 145.49,18.09 v145.29,18.29
  Bottom 0.406: X3.2 123,10.63 127.2,14.83 132.08,14.83 135.53,18.29 R6.1 v145.29,18.29 | R13.1 141.63,37.19 151.18,27.64 151.38,27.43 151.38,20.12 v149.35,18.09

## Text on the board
bNames: 1 | 1 | GND | FTDI | RESET | TX | RX | 1 | IGEP NEW YORK | 1 | 1 | RASPBERRY PI | 1 | PAD / MOTORS | Positive | Negative | Positive | Negative | One battery mode | 1 | GNDs | Negative | Positive | Switch | Switch | VIN_POWER | Moonwalker / ver: 1.0 | XAND logic gate / ppajuel / 2013 | GND_POWER | O | Bk | W&Be | G | Y